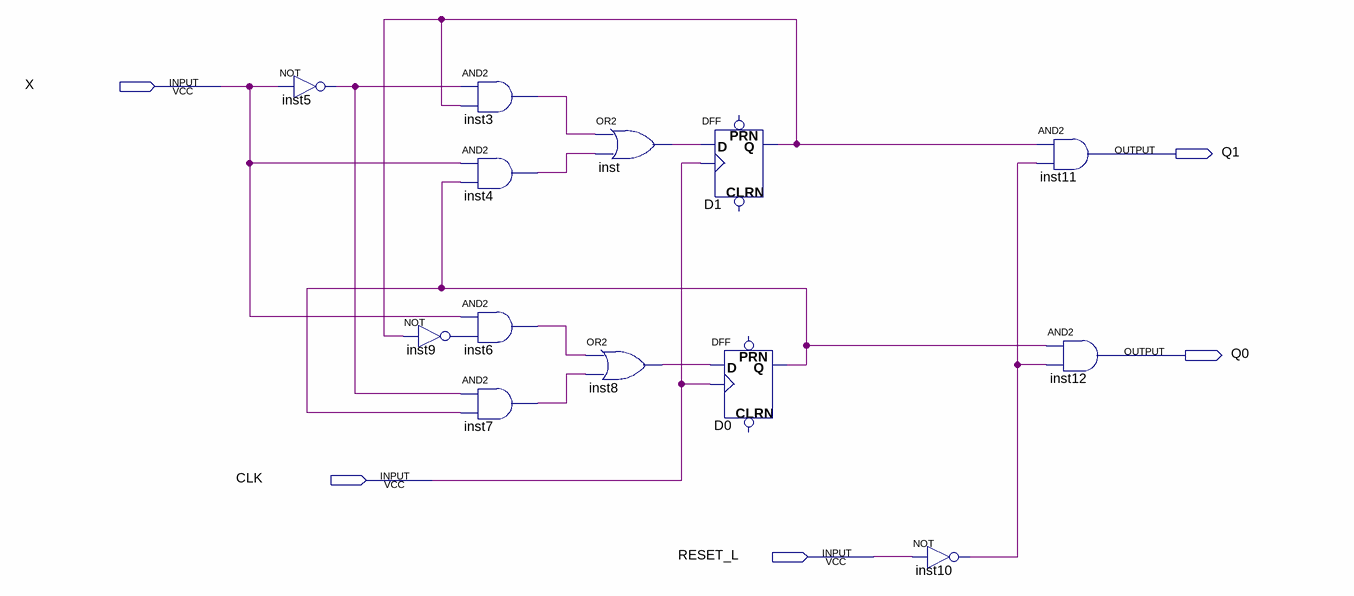
[diagram p0: schematic sheet]
// Quartus schematic MEF.bdf as structural Verilog: 13 symbols, 5 pins
module MEF (
  input  X,
  input  CLK,
  input  RESET_L,
  output Q1,
  output Q0
);

  wire D0_q, D1_q, inst3_out, inst4_out, inst5_out, inst6_out, inst7_out, inst8_out, inst9_out, inst10_out,
       inst_out;

  not inst5 (inst5_out, X);
  not inst9 (inst9_out, D1_q);
  and inst3 (inst3_out, inst5_out, D1_q);
  and inst4 (inst4_out, X, D0_q);
  and inst6 (inst6_out, X, inst9_out);
  and inst7 (inst7_out, inst5_out, D0_q);
  or inst8 (inst8_out, inst6_out, inst7_out);
  or inst (inst_out, inst3_out, inst4_out);
  DFF D1 (.CLK(CLK), .D(inst_out), .Q(D1_q));  // open: CLRN, PRN
  DFF D0 (.CLK(CLK), .D(inst8_out), .Q(D0_q));  // open: CLRN, PRN
  not inst10 (inst10_out, RESET_L);
  and inst11 (Q1, D1_q, inst10_out);
  and inst12 (Q0, D0_q, inst10_out);
endmodule
